# Altium schematic sheet ISM.SchDoc
size A4
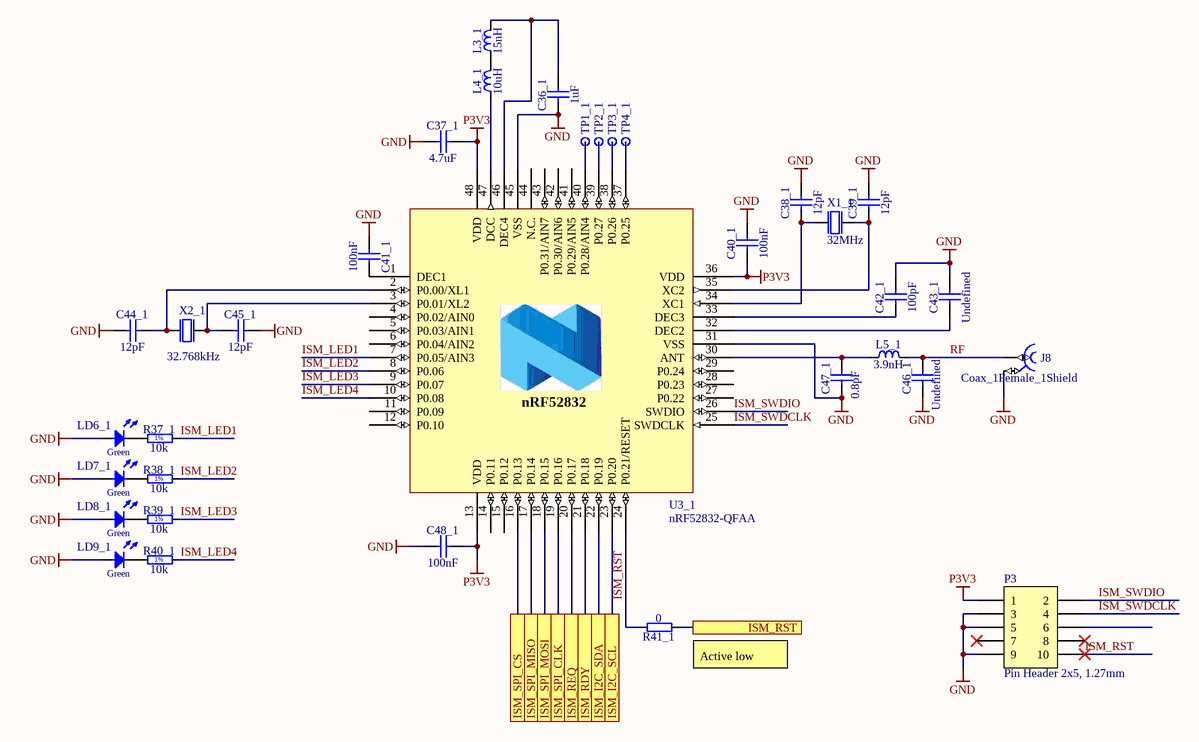
[diagram p0: ISM.SchDoc]

## Parts
C36_1  1uF  [CAPC1005X55N]
C37_1  4.7uF  [CAPC1709X95N]
C38_1  12pF  [CAPC1005X55N]
C39_1  12pF  [CAPC1005X55N]
C40_1  100nF  [CAPC1005X55N]
C41_1  100nF  [CAPC1005X55N]
C42_1  100pF  [CAPC1005X55N]
C43_1  Undefined  [CAPC1005X55N]
C44_1  12pF  [CAPC1005X55N]
C45_1  12pF  [CAPC1005X55N]
C46_1  Undefined  [CAPC1005X55N]
C47_1  0.8pF  [CAPC1005X55N]
C48_1  100nF  [CAPC1005X55N]
J8  Coax_1Female_1Shield  [HUBER-SUHNER_85_MMCX-50-0-1/111_OE]
L3_1  15nH  [INDC1005X55N]
L4_1  10uH  [INDC1005X55N]
L5_1  3.9nH  [INDC1005X55N]
LD6_1  Green  [LED_OSRAM_LGL29K]  (value not drawn)
LD7_1  Green  [LED_OSRAM_LGL29K]  (value not drawn)
LD8_1  Green  [LED_OSRAM_LGL29K]  (value not drawn)
LD9_1  Green  [LED_OSRAM_LGL29K]  (value not drawn)
P3  Pin Header 2x5, 1.27mm  [HDR_2x5-SMD-1.27mm-K]
R37_1  10k  [RESC1005X40N]
R38_1  10k  [RESC1005X40N]
R39_1  10k  [RESC1005X40N]
R40_1  10k  [RESC1005X40N]
R41_1  0  [RESC1005X40N]
TP1_1  Test Point  [TPS127]  (value not drawn)
TP2_1  Test Point  [TPS127]  (value not drawn)
TP3_1  Test Point  [TPS127]  (value not drawn)
TP4_1  Test Point  [TPS127]  (value not drawn)
U3_1  nRF52832-QFAA  [QFN40P600X600X90-48N]
X1_1  32MHz  [BT-XTAL_2016]
X2_1  32.768kHz  [XTAL_3215]

## Ports
ISM_I2C_SCL, ISM_I2C_SDA, ISM_RDY, ISM_REQ, ISM_RST, ISM_SPI_CLK, ISM_SPI_CS, ISM_SPI_MISO, ISM_SPI_MOSI

## Nets
GND: C36_1.1 C37_1.1 C38_1.2 C39_1.2 C40_1.2 C41_1.1 C42_1.2 C43_1.2 C44_1.1 C45_1.2 C46_1.1 C47_1.1 C48_1.1 J8.2 LD6_1.2(A) LD7_1.2(A) LD8_1.2(A) LD9_1.2(A) P3.3 P3.5 P3.9 U3_1.31(VSS) U3_1.45(VSS) U3_1.49(GND) X1_1.2(GND) X1_1.4(GND)
P3V3: C37_1.2 C40_1.1 C48_1.2 P3.1 U3_1.13(VDD) U3_1.36(VDD) U3_1.48(VDD)
ISM_I2C_SCL: U3_1.23(P0.20) ; port ISM_I2C_SCL
ISM_I2C_SDA: U3_1.22(P0.19) ; port ISM_I2C_SDA
ISM_LED1: R37_1.2 U3_1.7(P0.05/AIN3)
ISM_LED2: R38_1.2 U3_1.8(P0.06)
ISM_LED3: R39_1.2 U3_1.9(P0.07)
ISM_LED4: R40_1.2 U3_1.10(P0.08)
ISM_RDY: U3_1.21(P0.18) ; port ISM_RDY
ISM_REQ: U3_1.20(P0.17) ; port ISM_REQ
ISM_RST: P3.10 R41_1.2 U3_1.24(P0.21/RESET)
ISM_RST: R41_1.1 ; port ISM_RST  [a separate net that carries the same name]
ISM_SPI_CLK: U3_1.19(P0.16) ; port ISM_SPI_CLK
ISM_SPI_CS: U3_1.16(P0.13) ; port ISM_SPI_CS
ISM_SPI_MISO: U3_1.17(P0.14) ; port ISM_SPI_MISO
ISM_SPI_MOSI: U3_1.18(P0.15) ; port ISM_SPI_MOSI
ISM_SWDCLK: P3.4 U3_1.25(SWDCLK)
ISM_SWDIO: P3.2 U3_1.26(SWDIO)
RF: C46_1.2 J8.1 L5_1.2
NetC36_1_2: C36_1.2 L3_1.2 U3_1.46(DEC4)
NetC38_1_1: C38_1.1 U3_1.34(XC1) X1_1.1(inp)
NetC39_1_1: C39_1.1 U3_1.35(XC2) X1_1.3(out)
NetC41_1_2: C41_1.2 U3_1.1(DEC1)
NetC42_1_1: C42_1.1 U3_1.33(DEC3)
NetC43_1_1: C43_1.1 U3_1.32(DEC2)
NetC44_1_2: C44_1.2 U3_1.2(P0.00/XL1) X2_1.1(inp)
NetC45_1_1: C45_1.1 U3_1.3(P0.01/XL2) X2_1.2(out)
NetC47_1_2: C47_1.2 L5_1.1 U3_1.30(ANT)
NetL3_1_1: L3_1.1 L4_1.2
NetL4_1_1: L4_1.1 U3_1.47(DCC)
NetLD6_1_1: LD6_1.1(C) R37_1.1
NetLD7_1_1: LD7_1.1(C) R38_1.1
NetLD8_1_1: LD8_1.1(C) R39_1.1
NetLD9_1_1: LD9_1.1(C) R40_1.1
NetTP1_1_1: TP1_1.1 U3_1.40(P0.28/AIN4)
NetTP2_1_1: TP2_1.1 U3_1.39(P0.27)
NetTP3_1_1: TP3_1.1 U3_1.38(P0.26)
NetTP4_1_1: TP4_1.1 U3_1.37(P0.25)

Not connected (* = marked no-connect by the designer): P3 6 7* 8*; U3_1 4(P0.02/AIN0) 5(P0.03/AIN1) 6(P0.04/AIN2) 11(P0.09) 12(P0.10) 14(P0.11) 15(P0.12) 27(P0.22) 28(P0.23) 29(P0.24) 41(P0.29/AIN5) 42(P0.30/AIN6) 43(P0.31/AIN7) 44(N.C.)

## Notes on the sheet
- (near R41_1) Active low
- (in symbol nRF52832-QFAA) nRF52832
- (in symbol R0402_10K_1%_0.0625W_100PPM) 1%

## Library data of the parts
C36_1 = CC0402_1UF_16V_10%_X5R: Non-polarised capacitor; Part Description: SMD Multilayer Chip Ceramic Capacitor; Manufacturer: GENERIC; Manufacturer1 Part Number: C1005X5R1C105KT; Voltage: 16V; TC: X5R; Tolerance: ±10%; Part Number: CC0402_1UF_16V_10%_X5R; Component Kind: Standard; Component Type: Standard; Pin Count: 2; Value: 1uF; Status: Preferred; Manufacturer Part Number: CC0402_1UF_16V_10%_X5R; Case: 0402; Mounted: Yes; Socket: No; SMD: Yes; Sense: No; Manufacturer1 Example: TDK; Manufacturer1 ComponentHeight: 0.55mm; HelpURL: \\cern.ch\dfs\Applications\Altium\Datasheets\CC0402_X5R_TDK_C.pdf; Author: CERN DEM JLC; CreateDate: 2012-10-25; LatestRevisionDate: 2012-10-25
C37_1 = CC0603_4.7UF_16V_10%_X5R: Non-polarised capacitor; Part Description: SMD Multilayer Chip Ceramic Capacitor; Manufacturer: GENERIC; Manufacturer1 Part Number: EMK107ABJ475KA-T; Voltage: 16V; TC: X5R; Tolerance: ±10%; Part Number: CC0603_4.7UF_16V_10%_X5R; Component Kind: Standard; Component Type: Standard; Pin Count: 2; Value: 4.7uF; Status: None; Manufacturer Part Number: CC0603_4.7UF_16V_10%_X5R; Case: 0603; Mounted: Yes; Socket: No; SMD: Yes; Sense: No; Manufacturer1 Example: TAIYO YUDEN; Manufacturer1 ComponentHeight: 0.95mm; HelpURL: \\cern.ch\dfs\Applications\Altium\Datasheets\CC0603_X7R_TAIYO-YUDEN_HIGH-VALUE.pdf; Author: CERN DEM JLC; CreateDate: 2013-12-16; LatestRevisionDate: 2014-09-16
C38_1 C39_1 C44_1 C45_1 = CC0402_12PF_50V_5%_C0G: Non-polarised capacitor; Part Description: SMD Multilayer Chip Ceramic Capacitor; Manufacturer: GENERIC; Manufacturer1 Part Number: C0402C120J5GACTU; Voltage: 50V; TC: C0G/NP0; Tolerance: ±5%; Part Number: CC0402_12PF_50V_5%_C0G; Component Kind: Standard; Component Type: Standard; Pin Count: 2; Value: 12pF; Status: Preferred; Manufacturer Part Number: CC0402_12PF_50V_5%_C0G; Case: 0402; Mounted: Yes; Socket: No; SMD: Yes; Sense: No; Manufacturer1 Example: KEMET; Manufacturer1 ComponentHeight: 0.55mm; HelpURL: \\cern.ch\dfs\Applications\Altium\Datasheets\CC0805_C0G_KEMET_(Commercial Grade).pdf; Author: CERN DEM JLC; CreateDate: 2016-10-04; LatestRevisionDate: 2016-10-04
C40_1 C41_1 C48_1 = CC0402_100NF_16V_10%_X5R: Non-polarised capacitor; Part Description: SMD Multilayer Chip Ceramic Capacitor; Manufacturer: GENERIC; Manufacturer1 Part Number: GRM155R61C104KA88D; Voltage: 16V; TC: X5R; Tolerance: ±10%; Part Number: CC0402_100NF_16V_10%_X5R; Component Kind: Standard; Component Type: Standard; Pin Count: 2; Value: 100nF; Status: None; Manufacturer Part Number: CC0402_100NF_16V_10%_X5R; Case: 0402; Mounted: Yes; Socket: No; SMD: Yes; Sense: No; Manufacturer1 Example: MURATA; Manufacturer1 ComponentHeight: 0.55mm; HelpURL: \\cern.ch\dfs\Applications\Altium\Datasheets\CC0402_X5R_MURATA_GRM.pdf; Author: CERN DEM JLC; CreateDate: 2013-12-10; LatestRevisionDate: 2013-12-10
C42_1 = CC0402_100PF_50V_5%_C0G: Non-polarised capacitor; Part Description: SMD Multilayer Chip Ceramic Capacitor; Manufacturer: GENERIC; Manufacturer1 Part Number: C0402C101J5GACTU; Voltage: 50V; TC: C0G/NP0; Tolerance: ±5%; Part Number: CC0402_100PF_50V_5%_C0G; Component Kind: Standard; Component Type: Standard; Pin Count: 2; Value: 100pF; Status: Preferred; Manufacturer Part Number: CC0402_100PF_50V_5%_C0G; Case: 0402; Mounted: Yes; Socket: No; SMD: Yes; Sense: No; Manufacturer1 Example: KEMET; Manufacturer1 ComponentHeight: 0.55mm; HelpURL: \\cern.ch\dfs\Applications\Altium\Datasheets\CC0805_C0G_KEMET_(Commercial Grade).pdf; Author: CERN DEM JLC; CreateDate: 2007-12-03; LatestRevisionDate: 2015-04-22
C43_1 C46_1 = CC0402_NO-VALUE: Non-polarised capacitor; Part Description: Reserved Footprint For 0402(1005) Chip Ceramic Capacitor; Mounted: No; Part Number: CC0402_NO-VALUE; Component Kind: Standard; Component Type: Standard; Pin Count: 2; Value: Undefined; Status: None; Manufacturer: Undefined; Manufacturer Part Number: CC0402_NO-VALUE; Case: 0402; Socket: No; SMD: Yes; Sense: No; Manufacturer1 ComponentHeight: 0.55mm; HelpURL: Undefined; Author: CERN DEM JLC; CreateDate: 2014-01-14; LatestRevisionDate: 2014-01-14
C47_1 = CC0402_NO-VALUE: Non-polarised capacitor; Part Description: Reserved Footprint For 0402(1005) Chip Ceramic Capacitor; Value: Undefined; Mounted: No; Part Number: CC0402_NO-VALUE; Component Kind: Standard; Component Type: Standard; Pin Count: 2; Status: None; Manufacturer: Undefined; Manufacturer Part Number: CC0402_NO-VALUE; Case: 0402; Socket: No; SMD: Yes; Sense: No; Manufacturer1 ComponentHeight: 0.55mm; HelpURL: Undefined; Author: CERN DEM JLC; CreateDate: 2014-01-14; LatestRevisionDate: 2014-01-14
J8 = HUBER-SUHNER_85_MMCX-50-0-1/111_OE: Part Description: MMCX 50 Ohms Right Angle PCB Jack; Manufacturer: HUBER+SUHNER; PressFit: No; Part Number: HUBER-SUHNER_85_MMCX-50-0-1/111_OE; Component Kind: Standard; Component Type: Standard; Pin Count: 2; Family: MMCX; Mounted: Yes; Socket: No; SMD: No; Sense: No; Status: None; Manufacturer Part Number: 85_MMCX-50-0-1/111_OE; ComponentHeight: 9.6mm; HelpURL: \\cern.ch\dfs\Applications\Altium\Datasheets\HUBER-SUHNER_85_MMCX-50-0-1-111_OE.pdf; Author: CERN DEM JLC; CreateDate: 2014-11-06; LatestRevisionDate: 2014-11-06
L3_1 L4_1 L5_1 = IND0402_MURATA_BLM15HB221SN1: Inductor; Part Description: SMD EMIFIL Suppression Chip Ferrite Bead; Manufacturer: MURATA; Value: 220R@100MHz; Power: 250mA; Resistance: 1R; Tolerance: ±25%; Part Number: IND0402_MURATA_BLM15HB221SN1; Component Kind: Standard; Component Type: Standard; Pin Count: 2; Status: None; Manufacturer Part Number: BLM15HB221SN1; Case: 0402; Mounted: Yes; Socket: No; SMD: Yes; Sense: No; ComponentHeight: 0.55mm; HelpURL: \\cern.ch\dfs\Applications\Altium\Datasheets\IND0402_MURATA_BLM15H.pdf; Author: CERN DEM JLC; CreateDate: 2009-06-23; LatestRevisionDate: 2009-06-23
LD6_1 LD7_1 LD8_1 LD9_1 = LED_OSRAM_LG L29K-G2J1-24-Z: LED Green 1C 2A; Part Description: Surface Mount Green LED (0603 Case); Manufacturer: OSRAM; PressFit: No; Bonding: No; Part Number: LED_OSRAM_LG L29K-G2J1-24-Z; Component Kind: Standard; Component Type: Standard; Color: Green; PackageDescription: Green Chip LED, 2-Leads, Body 1.7x0.8mm, IPC Medium Density; Manufacturer Part Number: LG L29K-G2J1-24-Z; Pin Count: 2; Case: 0603; Mounted: Yes; Socket: No; SMD: Yes; Sense: No; ComponentHeight: 0.67mm; HelpURL: \\cern.ch\dfs\Applications\Altium\Datasheets\LED_OSRAM_LGL29K.pdf; Author: CERN DEM JLC; CreateDate: 2012-04-24; LatestRevisionDate: 2012-04-24
P3 = Pin Header 2x5 SMD, 1.27mm, KS: Pin Header 2x5, 1.27mm (50mil), SMD, Keying Shroud; Manufacturer: WCON; Manufacturer Part Number: 3132-10MS0BK00R1; 2nd source part number: FTSH-105-01-F-DV-K; Artikkelnr Noca: 55010009; Artikkelnr Simpro: N.A.; Part Number: Pin Header 2x5 SMD, 1.27mm, KS; Datasheet: \\hizz\pro\app9717\Datasheet\connectores\W-CON\3132-XXMXXBK00XX.pdf; Footprint Doc: HDR_2x5-SMD-1.27mm; LatestRevisionDate: 2016-04-21; Pin Count: 10; Publisher: Nordic Semiconductor; Published: 2016-01-22; Value: Pin Header 2x5, 1.27mm; Note: *; Supplier: Cabcon; Supplier part number: 3132-10MS0BK00R1; 2nd source Supplier: Samtec
R37_1 R38_1 R39_1 R40_1 = R0402_10K_1%_0.0625W_100PPM: Resistor - 1%; Part Description: General Purpose Thick Film Chip Resistor; Manufacturer: GENERIC; Manufacturer1 Part Number: 232270671003L; TC: ±100ppm/°C; Part Number: R0402_10K_1%_0.0625W_100PPM; Component Kind: Standard; Component Type: Standard; Pin Count: 2; Value: 10k; Status: Not recommended; Power: 0.0625W; Tolerance: ±1%; Manufacturer Part Number: R0402_10K_1%_0.0625W_100PPM; Case: 0402; Mounted: Yes; Sense: No; Socket: No; SMD: Yes; Manufacturer1 Example: YAGEO PHYCOMP; Manufacturer1 ComponentHeight: 0.4mm; HelpURL: \\cern.ch\dfs\Applications\Altium\Datasheets\R0402_Phycomp_RC0402.pdf; Author: CERN DEM JLC; CreateDate: 2007-12-03; LatestRevisionDate: 2012-10-17
R41_1 = R0402_0R_JUMPER: Resistor; Part Description: 1A (0.05R Max DC Resistance) Zero Ohm Jumper; Manufacturer: GENERIC; Manufacturer1 Part Number: 232270591001L; Part Number: R0402_0R_JUMPER; Component Kind: Standard; Component Type: Standard; Pin Count: 2; Value: 0; Status: Not recommended; Manufacturer Part Number: R0402_0R_JUMPER; Case: 0402; Mounted: Yes; Sense: No; Socket: No; SMD: Yes; Manufacturer1 Example: YAGEO PHYCOMP; Manufacturer1 ComponentHeight: 0.4mm; HelpURL: \\cern.ch\dfs\Applications\Altium\Datasheets\R0402_Phycomp_RC0402.pdf; Author: CERN DEM JLC; CreateDate: 2007-12-03; LatestRevisionDate: 2012-10-17
TP1_1 TP2_1 TP3_1 TP4_1 = SMD_PAD_1.27X1.27MM: Part Description: 1.27mm x 1.27mm PCB Copper Area (SMD Test Point); Mounted: No; Part Number: SMD_PAD_1.27X1.27MM; Component Kind: Standard (No BOM); Component Type: Standard (No BOM); Pin Count: 1; Family: Test Point; Socket: No; SMD: Yes; Sense: No; Status: None; ComponentHeight: 0mm; HelpURL: Undefined; Author: CERN DEM JLC; CreateDate: 2008-01-12; LatestRevisionDate: 2008-01-12; PackageDescription: 1.27mm x 1.27mm PCB Copper Area (SMD Test Point)
U3_1 = nRF52832-QFAA: Multi-protocol Bluetooth Low Energy and 2.4GHz proprietary system-on-chip; Manufacturer: Nordic Semiconductor; Artikkelnr Noca: N.A.; Part Number: nRF52832-QFAA; Manufacturer Part Number: nRF52832-QFAA; Datasheet: *; LatestRevisionDate: 2014-11-26; Pin Count: 48; Publisher: Nordic Semiconductor; Published: 2014-11-26; Value: nRF52832-QFAA; Note: *; Supplier: Nordic Semiconductor; Supplier part number: *; 2nd source Supplier: *; 2nd source part number: *; Footprint Doc: QFN-48; Artikkelnr Simpro: N.A.
X1_1 = XTAL_SMD2016_32MHz_8pF_Epson: XTAL SMD 2016, 32MHz, Cl=8pF, Tol: ±10ppm, Stab: ±10ppm; Manufacturer: Epson Toyocom; Manufacturer Part Number: Q22FA12800025; Note: XTAL SMD 32.000MHz; Artikkelnr Noca: N.A.; Part Number: XTAL_SMD2016_32MHz_8pF_Epson; Datasheet: http://www.epsondevice.com/docs/qd/en/DownloadServlet?id=ID000449; LatestRevisionDate: 2014-11-27; Pin Count: 4; Publisher: Nordic Semiconductor; Published: 2012-03-09; Value: 32MHz; Supplier: Farnell; Supplier part number: 171-2806; 2nd source Supplier: *; 2nd source part number: *; Footprint Doc: XTAL_2016; Artikkelnr Simpro: N.A.
X2_1 = XTAL_FC-135 32.768k: EPSON TOYOCOM - FC-135 32.768KHZ ±20PPM,9.0PF - CRYSTAL, SM, WATCH; 2nd source part number: 127-8037; Note: XTAL SMD 32.768kHz, 3215; Artikkelnr Noca: 22019091; Artikkelnr Simpro: N.A.; Part Number: XTAL_FC-135 32.768k; Manufacturer: Epson Toyocom; Manufacturer Part Number: FC-135 32.768KHZ ±20PPM,9.0PF; Datasheet: http://www.farnell.com/datasheets/57480.pdf; LatestRevisionDate: 2014-03-27; Pin Count: 2; Publisher: Nordic Semiconductor; Published: 2010-10-18; Value: 32.768kHz; Supplier: Digi-Key; Supplier part number: FC-135 32.7680KA-AC-ND; 2nd source Supplier: Farnell; Footprint Doc: XTAL_3215